# Altium schematic sheet Sheet1.SchDoc
size A4
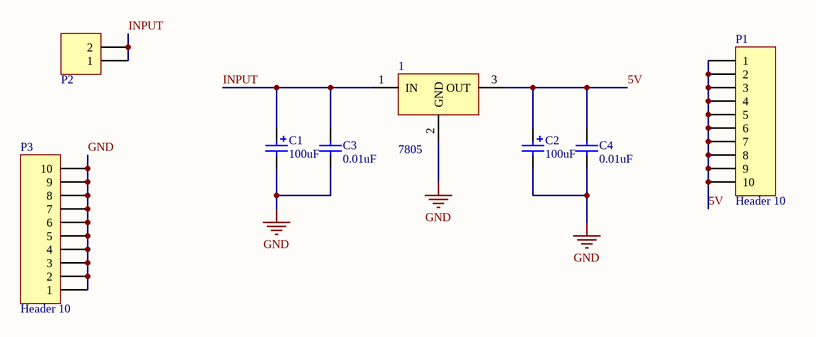
[diagram p0: Sheet1.SchDoc]

## Parts
1  7805  [TO-220]
C1  value 100uF  [RB2]  (hidden comment: Cap2)
C2  value 100uF  [RB2]  (hidden comment: Cap2)
C3  value 0.01uF  [RAD0.1]  (hidden comment: Cap1)
C4  value 0.01uF  [RAD0.1]  (hidden comment: Cap1)
P1  Header 10  [SIP-10]
P2  Header 2  [HDR2X1_A]  (value not drawn)
P3  Header 10  [SIP-10]

## Nets
GND: 1.2(GND) C1.2 C2.2 C3.1 C4.1 P3.1 P3.2 P3.3 P3.4 P3.5 P3.6 P3.7 P3.8 P3.9 P3.10
5V: 1.3(OUT) C2.1 C4.2 P1.1 P1.2 P1.3 P1.4 P1.5 P1.6 P1.7 P1.8 P1.9 P1.10
INPUT: 1.1(IN) C1.1 C3.2 P2.1 P2.2

## Library data of the parts
P1 P3 = Header 10: Header, 10-Pin; LatestRevisionDate: 17-Jul-2002; LatestRevisionNote: Re-released for DXP Platform.; Publisher: Altium Limited
P2 = Header 2: 接插件; LatestRevisionDate: 17-Jul-2002; LatestRevisionNote: Re-released for DXP Platform.; Publisher: Altium Limited